# Altium schematic sheet OSD19001_CORE.SchDoc: <title>
size B; Organization: Altium Limited; DocumentNumber: 2; SheetNumber: 2; SheetTotal: 4; DrawingNumber: <drawing number>; SchematicTitle: OSD32MP1 BREAKOUT MODULE (CORE)
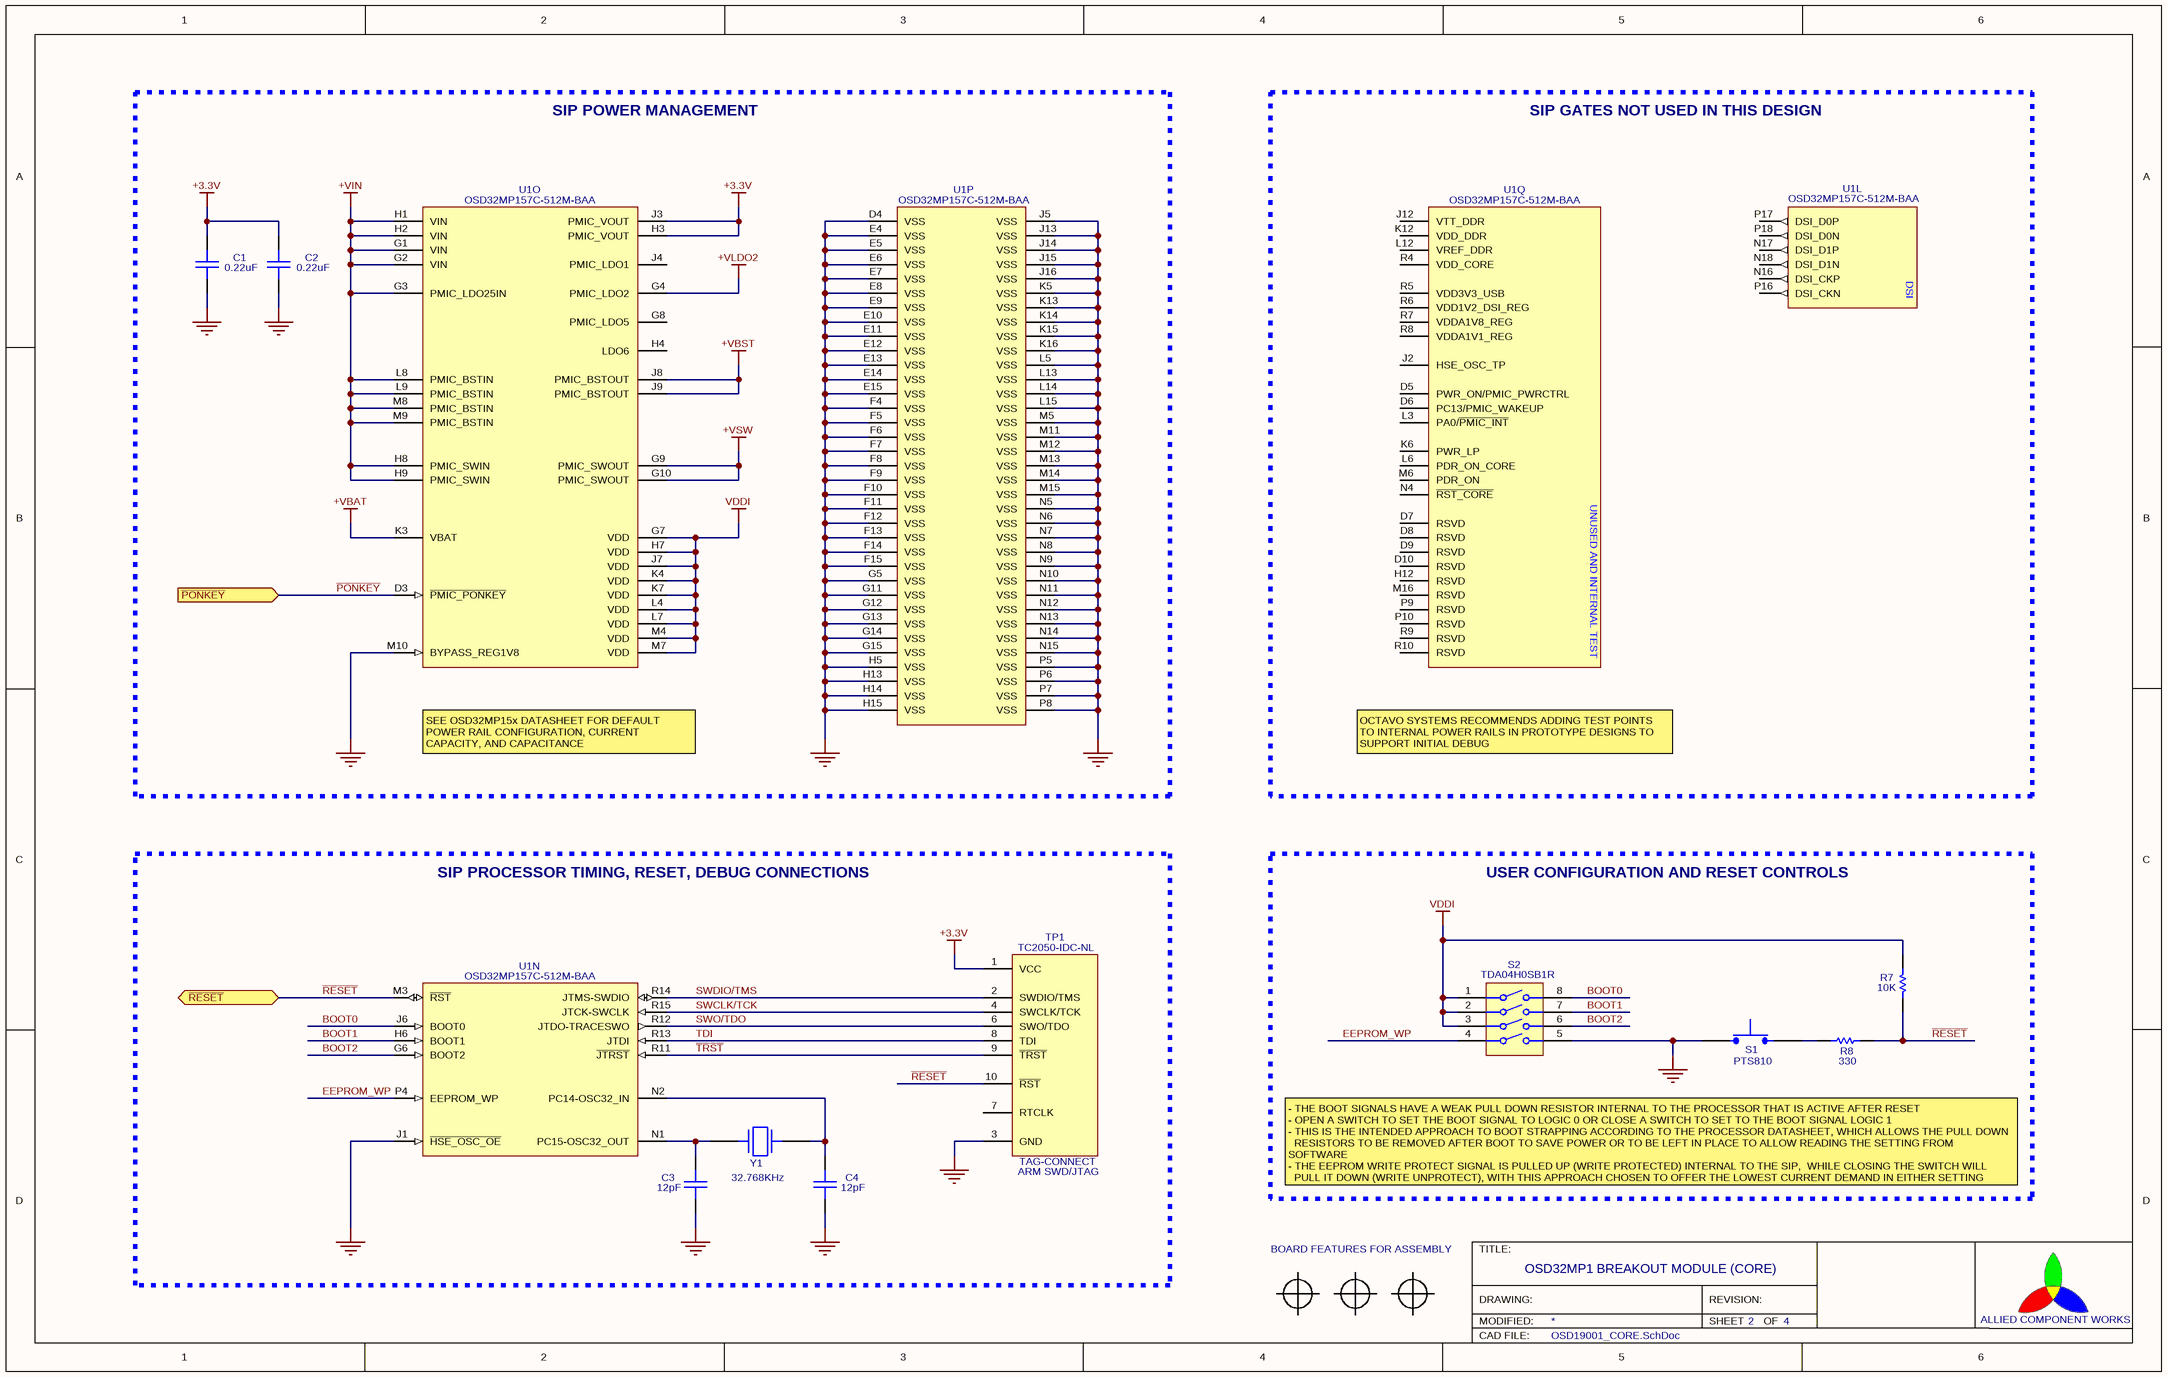
[diagram p0: OSD19001_CORE.SchDoc]

## Parts
C1  0.22uF  [LP_0603_HIGH]
C2  0.22uF  [LP_0603_HIGH]
C3  12pF  [LP_0402_HIGH]
C4  12pF  [LP_0402_HIGH]
FID1  FID  [FID_ROUND_40_TOP]  (value not drawn)
FID2  FID  [FID_ROUND_40_TOP]  (value not drawn)
FID3  FID  [FID_ROUND_40_TOP]  (value not drawn)
R7  10K  [LP_0402_LOW]
R8  330  [LP_0402_LOW]
S1  PTS810  [C&K_PTS810]
S2  TDA04H0SB1R  [C&K_TDA04]
TP1  TC2050-IDC-NL  [TC2050_SITE_NL]
U1  OSD32MP157C-512M-BAA  [BGA_OCTAVO_SIP_OSD32MP157C]  (parts L,N,O,P,Q of 17)
Y1  32.768KHz  [NDK_CRYSTAL_1.5X3.2]

## Blocks framed on the sheet
SIP POWER MANAGEMENT: C1 C2 U1
SIP GATES NOT USED IN THIS DESIGN: U1
SIP PROCESSOR TIMING, RESET, DEBUG CONNECTIONS: C3 C4 TP1 U1 Y1
USER CONFIGURATION AND RESET CONTROLS: R7 R8 S1 S2

## Ports
~{PONKEY} (in), ~{RESET} (bidir)

## Nets
+3.3V: C1.1 C2.1 TP1.1(VCC) U1.H3(PMIC_VOUT) U1.J3(PMIC_VOUT)
+VBAT: U1.K3(VBAT)
+VBST: U1.J8(PMIC_BSTOUT) U1.J9(PMIC_BSTOUT)
+VIN: U1.G1(VIN) U1.G2(VIN) U1.G3(PMIC_LDO25IN) U1.H1(VIN) U1.H2(VIN) U1.H8(PMIC_SWIN) U1.H9(PMIC_SWIN) U1.L8(PMIC_BSTIN) U1.L9(PMIC_BSTIN) U1.M8(PMIC_BSTIN) U1.M9(PMIC_BSTIN)
+VLDO2: U1.G4(PMIC_LDO2)
+VSW: U1.G9(PMIC_SWOUT) U1.G10(PMIC_SWOUT)
GND: C1.2 C2.2 C3.2 C4.2 S1.2 S2.5 TP1.3(GND) U1.D4(VSS) U1.E4(VSS) U1.E5(VSS) U1.E6(VSS) U1.E7(VSS) U1.E8(VSS) U1.E9(VSS) U1.E10(VSS) U1.E11(VSS) U1.E12(VSS) U1.E13(VSS) U1.E14(VSS) U1.E15(VSS) U1.F4(VSS) U1.F5(VSS) U1.F6(VSS) U1.F7(VSS) U1.F8(VSS) U1.F9(VSS) U1.F10(VSS) U1.F11(VSS) U1.F12(VSS) U1.F13(VSS) U1.F14(VSS) U1.F15(VSS) U1.G5(VSS) U1.G11(VSS) U1.G12(VSS) U1.G13(VSS) U1.G14(VSS) U1.G15(VSS) U1.H5(VSS) U1.H13(VSS) U1.H14(VSS) U1.H15(VSS) U1.J1(~{HSE_OSC_OE}) U1.J5(VSS) U1.J13(VSS) U1.J14(VSS) U1.J15(VSS) U1.J16(VSS) U1.K5(VSS) U1.K13(VSS) U1.K14(VSS) U1.K15(VSS) U1.K16(VSS) U1.L5(VSS) U1.L13(VSS) U1.L14(VSS) U1.L15(VSS) U1.M5(VSS) U1.M10(BYPASS_REG1V8) U1.M11(VSS) U1.M12(VSS) U1.M13(VSS) U1.M14(VSS) U1.M15(VSS) U1.N5(VSS) U1.N6(VSS) U1.N7(VSS) U1.N8(VSS) U1.N9(VSS) U1.N10(VSS) U1.N11(VSS) U1.N12(VSS) U1.N13(VSS) U1.N14(VSS) U1.N15(VSS) U1.P5(VSS) U1.P6(VSS) U1.P7(VSS) U1.P8(VSS)
VDDI: R7.2 S2.1 S2.2 S2.3 U1.G7(VDD) U1.H7(VDD) U1.J7(VDD) U1.K4(VDD) U1.K7(VDD) U1.L4(VDD) U1.L7(VDD) U1.M4(VDD) U1.M7(VDD)
~{PONKEY}: U1.D3(~{PMIC_PONKEY}) ; port ~{PONKEY}
~{RESET}: R7.1 R8.2 TP1.10(~{RST}) U1.M3(~{RST}) ; port ~{RESET}
~{TRST}: TP1.9(~{TRST}) U1.R11(~{JTRST})
BOOT0: S2.8 U1.J6(BOOT0)
BOOT1: S2.7 U1.H6(BOOT1)
BOOT2: S2.6 U1.G6(BOOT2)
EEPROM_WP: S2.4 U1.P4(EEPROM_WP)
SWCLK/TCK: TP1.4(SWCLK/TCK) U1.R15(JTCK-SWCLK)
SWDIO/TMS: TP1.2(SWDIO/TMS) U1.R14(JTMS-SWDIO)
SWO/TDO: TP1.6(SWO/TDO) U1.R12(JTDO-TRACESWO)
TDI: TP1.8(TDI) U1.R13(JTDI)
NetC3_1: C3.1 U1.N1(PC15-OSC32_OUT) Y1.2
NetC4_1: C4.1 U1.N2(PC14-OSC32_IN) Y1.1
NetR8_1: R8.1 S1.1

Not connected (* = marked no-connect by the designer): TP1 7(RTCLK); U1 D5(PWR_ON/PMIC_PWRCTRL) D6(PC13/PMIC_WAKEUP) D7(RSVD) D8(RSVD) D9(RSVD) D10(RSVD) G8(PMIC_LDO5) H4(LDO6) H12(RSVD) J2(HSE_OSC_TP) J4(PMIC_LDO1) J12(VTT_DDR) K6(PWR_LP) K12(VDD_DDR) L3(PA0/~{PMIC_INT}) L6(PDR_ON_CORE) L12(VREF_DDR) M6(PDR_ON) M16(RSVD) N4(~{RST_CORE}) N16(DSI_CKP) N17(DSI_D1P) N18(DSI_D1N) P9(RSVD) P10(RSVD) P16(DSI_CKN) P17(DSI_D0P) P18(DSI_D0N) R4(VDD_CORE) R5(VDD3V3_USB) R6(VDD1V2_DSI_REG) R7(VDDA1V8_REG) R8(VDDA1V1_REG) R9(RSVD) R10(RSVD)

## Notes on the sheet
- SEE OSD32MP15x DATASHEET FOR DEFAULT POWER RAIL CONFIGURATION, CURRENT CAPACITY, AND CAPACITANCE RECOMMENDATIONS
- OCTAVO SYSTEMS RECOMMENDS ADDING TEST POINTS
  TO INTERNAL POWER RAILS IN PROTOTYPE DESIGNS TO SUPPORT INITIAL DEBUG
- - THE BOOT SIGNALS HAVE A WEAK PULL DOWN RESISTOR INTERNAL TO THE PROCESSOR THAT IS ACTIVE AFTER RESET
  - OPEN A SWITCH TO SET THE BOOT SIGNAL TO LOGIC 0 OR CLOSE A SWITCH TO SET TO THE BOOT SIGNAL LOGIC 1
  - THIS IS THE INTENDED APPROACH TO BOOT STRAPPING ACCORDING TO THE PROCESSOR DATASHEET, WHICH ALLOWS THE PULL DOWN
  RESISTORS TO BE REMOVED AFTER BOOT TO SAVE POWER OR TO BE LEFT IN PLACE TO ALLOW READING THE SETTING FROM SOFTWARE
  - THE EEPROM WRITE PROTECT SIGNAL IS PULLED UP (WRITE PROTECTED) INTERNAL TO THE SIP,  WHILE CLOSING THE SWITCH WILL
  PULL IT DOWN (WRITE UNPROTECT), WITH THIS APPROACH CHOSEN TO OFFER THE LOWEST CURRENT DEMAND IN EITHER SETTING
- BOARD FEATURES FOR ASSEMBLY
- TITLE:
- DRAWING:
- MODIFIED:
- REVISION:
- SHEET
- OF
- ALLIED COMPONENT WORKS
- CAD FILE:
- (in symbol OSD32MP157C, part L) DSI
- (in symbol OSD32MP157C, part Q) UNUSED AND INTERNAL TEST
- (in symbol TC2050) TAG-CONNECT; ARM SWD/JTAG

## Library data of the parts
C1-C4 = CERCAP: Tolerance: 10%; Voltage: 25V
  C1 C2: Value: 0.22uF
  C3 C4: PartNumber: *; Value: 12pF
FID1-FID3 = FIDUCIAL
R7 R8 = RESISTOR: Tolerance: 5%; Power: 0.1W; Voltage: 50V
  R7: Value: 10K
  R8: Value: 330
S1 = TACT_SWITCH: SPST Tactile Switch, 2 Active Pins; PartNumber: PTS810
S2 = DIP_SW_4: Four Position DIP Switch; PartNumber: TDA04H0SB1R
TP1 = TC2050: Tag Connect Site, 10-Pin; PartNumber: TC2050-IDC-NL
U1 = OSD32MP157C: Octavo ST Processor SIP; Manufacturer: Octavo Systems; PartNumber: OSD32MP157C-512M-BAA; ComponentLink1Description: TBD; ComponentLink1URL: http://TBD
Y1 = CRYSTAL_2PIN: Crystal; PartNumber: NX3215SA-32.768K-STD-MUA-9; Frequency: 32.768KHz